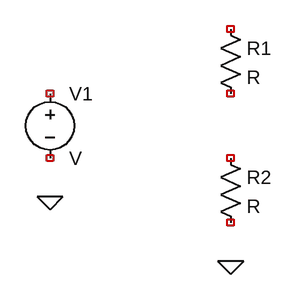
[diagram p0: schematic Draft1.asc]
Draft1.asc, the LTspice schematic file:
Version 4.1
SHEET 1 880 680
FLAG 96 160 0
FLAG 320 240 0
SYMBOL voltage 96 16 R0
SYMATTR InstName V1
SYMBOL res 304 -64 R0
SYMATTR InstName R1
SYMBOL res 304 96 R0
SYMATTR InstName R2

The netlist it stands for:
* Draft1.asc
V1 NC_01 NC_02 V
R1 NC_03 NC_04 R
R2 NC_05 NC_06 R
.backanno
.end